# Altium schematic sheet sonar_rx.SchDoc
size A4
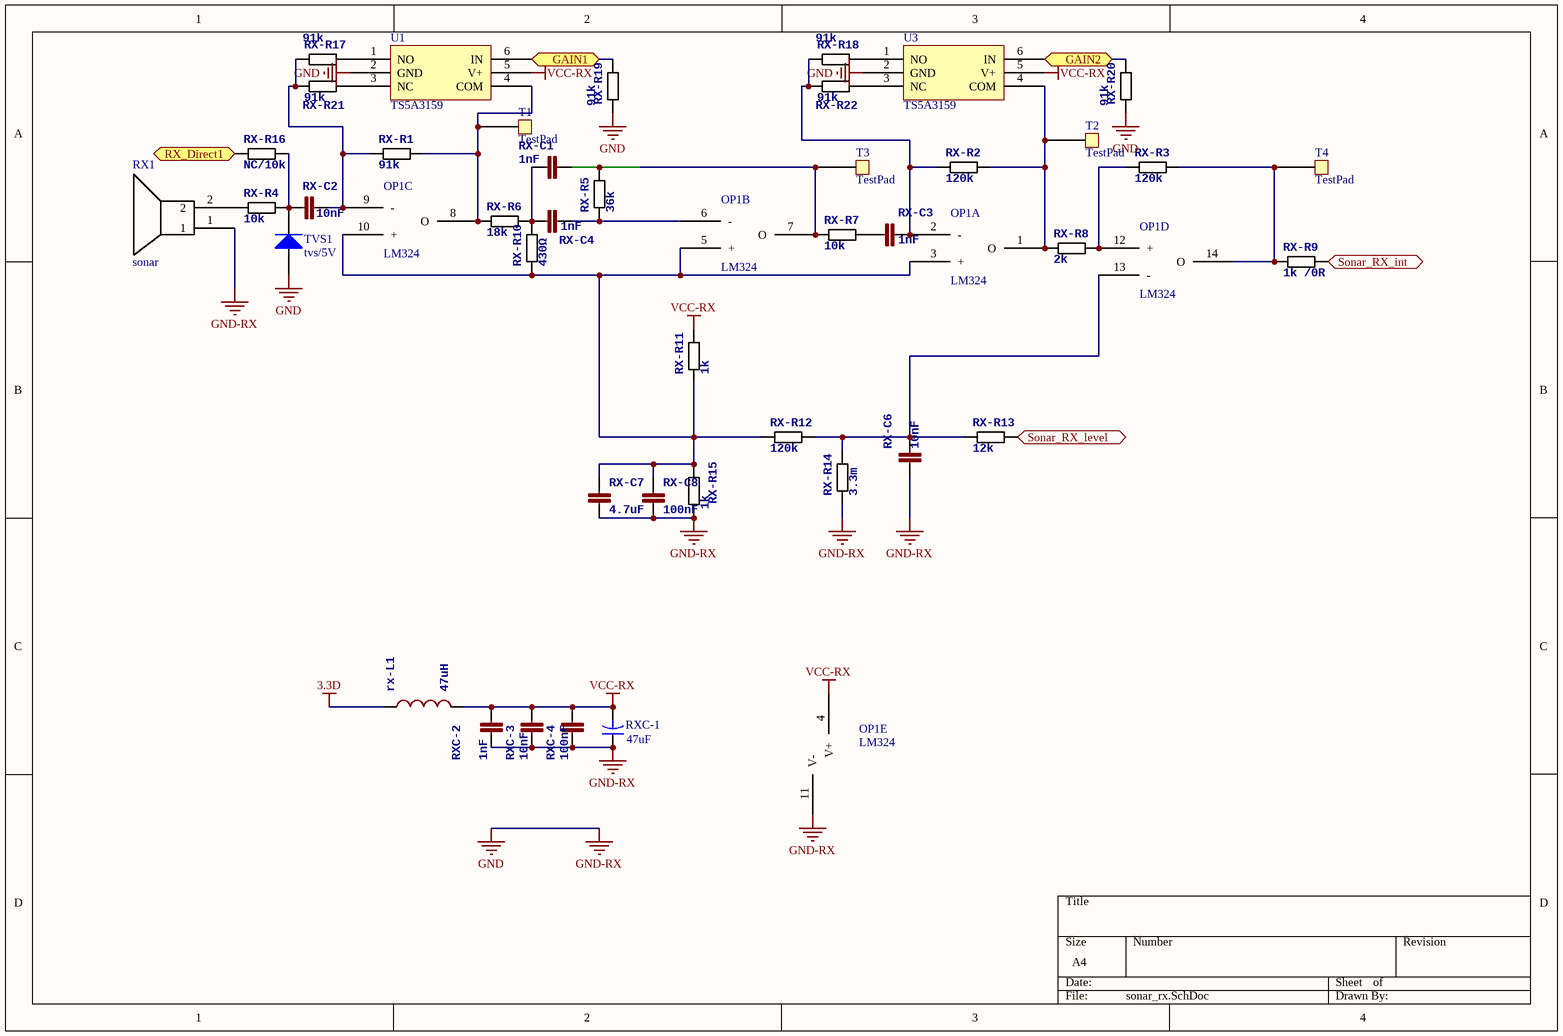
[diagram p0: sonar_rx.SchDoc]

## Parts
OP1  LM324  (parts A,B,C,D,E of 5)
RX1  sonar  [sonar-16mm]
RX-C1  1nF  [0402]
RX-C2  10nF  [0402]
RX-C3  1nF  [0402]
RX-C4  1nF  [0402]
RX-C6  10nF  [0402]
RX-C7  4.7uF  [0402]
RX-C8  100nF  [0402]
rx-L1  47uH  [0805-IND]
RX-R1  91k  [0402]
RX-R2  120k  [0402]
RX-R3  120k  [0402]
RX-R4  10k  [0402]
RX-R5  36k  [0402]
RX-R6  18k  [0402]
RX-R7  10k  [0402]
RX-R8  2k  [0402]
RX-R9  1k /0R  [0402]
RX-R10  430Ω  [0402]
RX-R11  1k  [0402]
RX-R12  120k  [0402]
RX-R13  12k  [0402]
RX-R14  3.3m  [0402]
RX-R15  1k  [0402]
RX-R16  NC/10k  [0402]
RX-R17  91k  [0402]
RX-R18  91k  [0402]
RX-R19  91k  [0402]
RX-R20  91k  [0402]
RX-R21  91k  [0402]
RX-R22  91k  [0402]
RXC-1  47uF  [C0805]
RXC-2  1nF  [0402]
RXC-3  10nF  [0402]
RXC-4  100nF  [0402]
T1  TestPad  [TestPad - 1mm]
T2  TestPad  [TestPad - 1mm]
T3  TestPad  [TestPad - 1mm]
T4  TestPad  [TestPad - 1mm]
TVS1  tvs/5V  [0805]
U1  TS5A3159  [SOT23-6]
U3  TS5A3159  [SOT23-6]

## Ports
GAIN1, GAIN2, RX_Direct1, Sonar_RX_int, Sonar_RX_level

## Nets
3.3D: rx-L1.1
GND: OP1.11(V-) RX1.1 RX-C6.1 RX-C7.2 RX-C8.2 RX-R14.1 RX-R15.1 RX-R19.1 RX-R20.1 RXC-1.1 RXC-2.1 RXC-3.1 RXC-4.1 TVS1.1(A) U1.2(GND) U3.2(GND)  [also labelled GND-RX]
VCC-RX: OP1.4(V+) rx-L1.2 RX-R11.2 RXC-1.2 RXC-2.2 RXC-3.2 RXC-4.2 U1.5(V+) U3.5(V+)
GAIN1: RX-R19.2 U1.6(IN) ; port GAIN1
GAIN2: RX-R20.2 U3.6(IN) ; port GAIN2
RX_Direct1: RX-R16.1 ; port RX_Direct1
Sonar_RX_int: RX-R9.2 ; port Sonar_RX_int
Sonar_RX_level: RX-R13.2 ; port Sonar_RX_level
NetOP1_1: OP1.1(O) RX-R2.2 RX-R8.1 T2.1 U3.4(COM)
NetOP1_2: OP1.2(-) RX-C3.2 RX-R2.1 RX-R18.1 RX-R22.1
NetOP1_3: OP1.3(+) OP1.5(+) OP1.10(+) RX-C7.1 RX-C8.1 RX-R10.1 RX-R11.1 RX-R12.1 RX-R15.2
NetOP1_6: OP1.6(-) RX-C4.2 RX-R5.1
NetOP1_7: OP1.7(O) RX-C1.2 RX-R5.2 RX-R7.1 T3.1
NetOP1_8: OP1.8(O) RX-R1.2 RX-R6.1 T1.1 U1.4(COM)
NetOP1_9: OP1.9(-) RX-C2.2 RX-R1.1 RX-R17.1 RX-R21.1
NetOP1_12: OP1.12(+) RX-R3.1 RX-R8.2
NetOP1_13: OP1.13(-) RX-C6.2 RX-R12.2 RX-R13.1 RX-R14.2
NetOP1_14: OP1.14(O) RX-R3.2 RX-R9.1 T4.1
NetRX1_2: RX1.2 RX-R4.1
NetRX-C1_1: RX-C1.1 RX-C4.1 RX-R6.2 RX-R10.2
NetRX-C2_1: RX-C2.1 RX-R4.2 RX-R16.2 TVS1.2(K)
NetRX-C3_1: RX-C3.1 RX-R7.2
NetRX-R17_2: RX-R17.2 U1.1(NO)
NetRX-R18_2: RX-R18.2 U3.1(NO)
NetRX-R21_2: RX-R21.2 U1.3(NC)
NetRX-R22_2: RX-R22.2 U3.3(NC)

## Library data of the parts
OP1 = OP-SOP14
RX-C1-RX-C4 RX-C6 RXC-2-RXC-4 = CAP0603H: <b>Capacitor</b> / Standard 0603 ceramic capacitor, and 0.1" leaded capacitor.; PARTNO: CC0603ZRY5V7BB105
RX-C7 RX-C8 = CAP0603: <b>Capacitor</b> / Standard 0603 ceramic capacitor, and 0.1" leaded capacitor.; PARTNO: CC0603ZRY5V7BB105
rx-L1 = INDUCTOR0805: <b>Inductors</b> / Basic Inductor/Choke - 0603 and 1210. Footprints are not proven and vary greatly between part numbers. / SRR1210: Bourns SRR1210 parts, e.g. SRR1210-100M; PARTNO: MLZ2012M470W
RX-R1-RX-R22 = RESISTOR0603B: <b>Resistor</b> / Basic schematic elements and footprints for 0603, 1206, and PTH 1/10th watt (small) resistors.; PARTNO: RMCF0402FT453K
RXC-1 = Cap2: Capacitor; Published: 23-Sep-2002; PackageReference: CAPR5-4X5; Publisher: Altium Limited; PackageDescription: Capacitor; 2 Leads; Value: 47uF
TVS1 = Diode: Default Diode; Published: 8-Jun-2000; LatestRevisionDate: 17-Jul-2002; LatestRevisionNote: Re-released for DXP Platform.; PackageVersion: Sep-1996; PackageReference: SMC; Publisher: Altium Limited; PackageDescription: DO-214-AB/SMC; 2 C-Bend Leads; Body 7.9 x 5.9 mm, inc. leads (LxW); Code_JEDEC: DO-214-AB